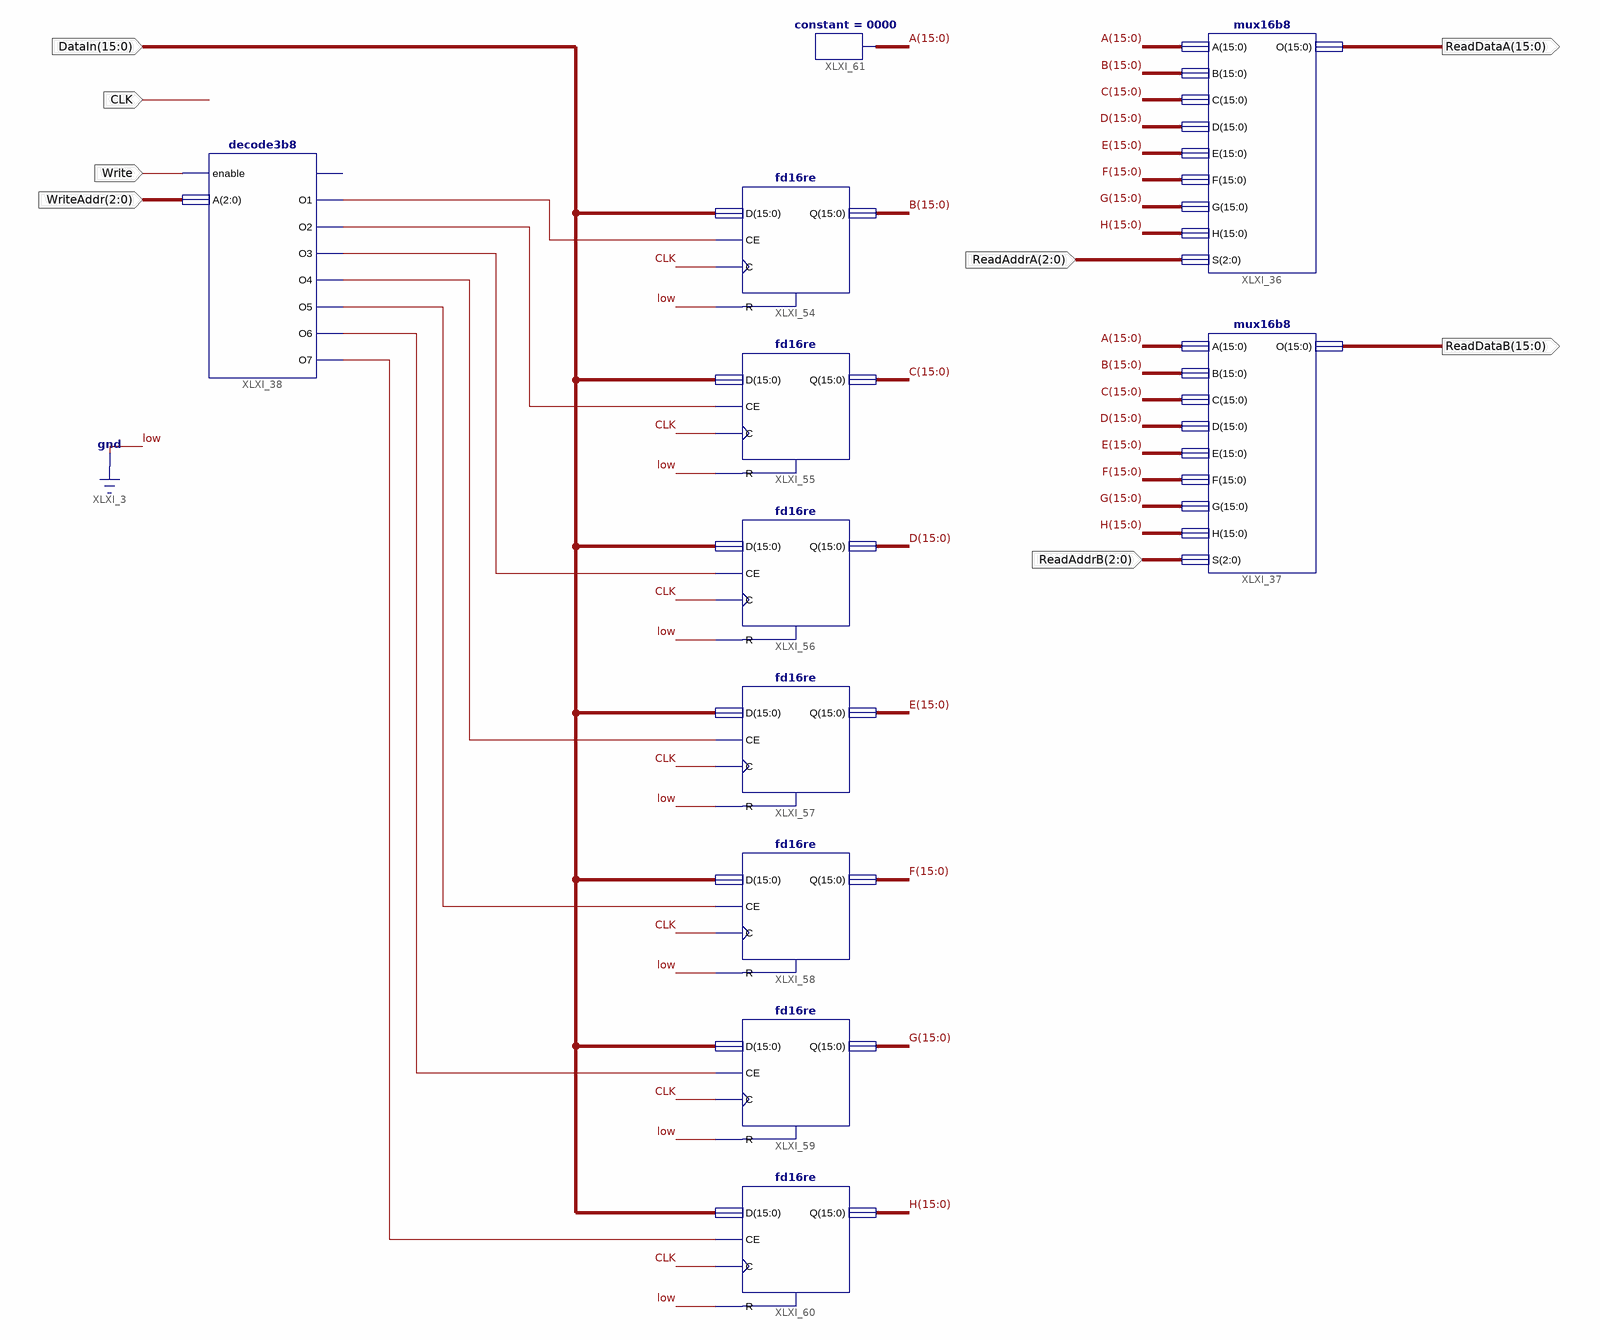
[diagram p0: schematic sheet 1]
// Xilinx ISE schematic regFile16b8.sch (spartan3e) as structural Verilog: 11 symbols, 8 ports
module regFile16b8 (
  input  CLK,
  input  [15:0] DataIn,
  input  Write,
  input  [2:0] WriteAddr,
  input  [2:0] ReadAddrA,
  input  [2:0] ReadAddrB,
  output [15:0] ReadDataA,
  output [15:0] ReadDataB
);

  wire XLXN_130, XLXN_132, XLXN_133, XLXN_134, XLXN_135, XLXN_136, XLXN_142;
  wire [15:0] A, B, C, D, E, F, G, H;

  mux16b8 XLXI_36 (.A(A), .B(B), .C(C), .D(D), .E(E), .F(F), .G(G), .H(H), .S(ReadAddrA), .O(ReadDataA));
  mux16b8 XLXI_37 (.A(A), .B(B), .C(C), .D(D), .E(E), .F(F), .G(G), .H(H), .S(ReadAddrB), .O(ReadDataB));
  decode3b8 XLXI_38 (
    .O1(XLXN_130), .O2(XLXN_142), .O3(XLXN_132), .O5(XLXN_134), .O6(XLXN_135), .O7(XLXN_136), .O4(XLXN_133),
    .A(WriteAddr), .enable(Write));  // open: O0
  fd16re XLXI_54 (.C(CLK), .CE(XLXN_130), .D(DataIn), .R(1'b0), .Q(B));
  fd16re XLXI_55 (.C(CLK), .CE(XLXN_142), .D(DataIn), .R(1'b0), .Q(C));
  fd16re XLXI_56 (.C(CLK), .CE(XLXN_132), .D(DataIn), .R(1'b0), .Q(D));
  fd16re XLXI_57 (.C(CLK), .CE(XLXN_133), .D(DataIn), .R(1'b0), .Q(E));
  fd16re XLXI_58 (.C(CLK), .CE(XLXN_134), .D(DataIn), .R(1'b0), .Q(F));
  fd16re XLXI_59 (.C(CLK), .CE(XLXN_135), .D(DataIn), .R(1'b0), .Q(G));
  fd16re XLXI_60 (.C(CLK), .CE(XLXN_136), .D(DataIn), .R(1'b0), .Q(H));
  constant #(.CValue("0000")) XLXI_61 (.O(A));
endmodule
